# Altium project Receiver_prj.PrjPcb
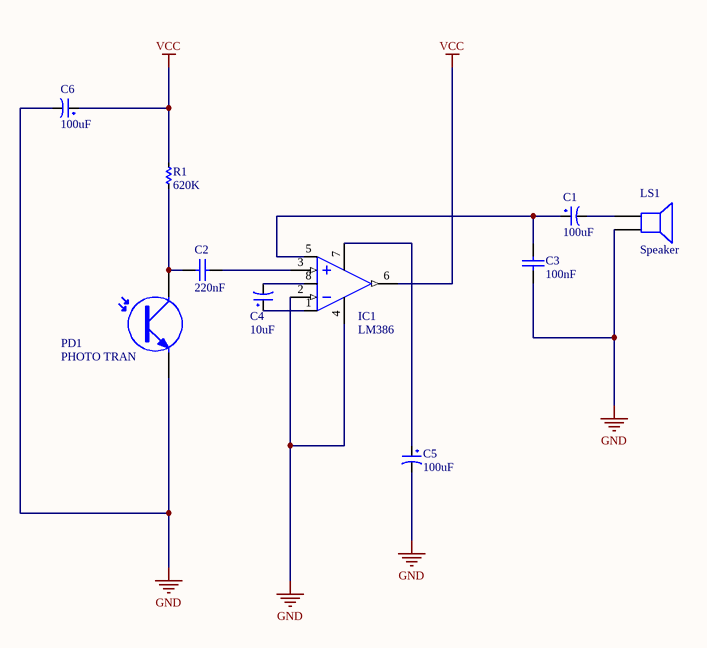
[diagram p0: receiver_SCH.SchDoc]
1 sheet, 10 parts. Net scope: global (net labels, ports and power ports of the same name join across sheets).
Board file: receiver_PCB.PcbDoc

## Sheet receiver_SCH.SchDoc
size A; SheetNumber: 1; SheetTotal: 1

### Parts
C1  100uF  [tu hoa 5mm]
C2  value 220nF  [CN1.5]  (hidden comment: Cap Non-Pol)
C3  value 100nF  [CN1.5]  (hidden comment: Cap Non-Pol)
C4  10uF  [tu hoa 4mm]
C5  100uF  [tu hoa 5mm]
C6  100uF  [tu hoa 5mm]
IC1  LM386  [DIP8]
LS1  Speaker  [SP1]
PD1  PHOTO TRAN  [LED-5TRED]
R1  620K  [RES-2W]

### Nets
GND: C3.2 C5.2 C6.2 IC1.2(IN-) IC1.4(-V) LS1.2 PD1.2(E)
VCC: C6.1 IC1.6(OUT) R1.1
NetC1_1: C1.1 C3.1 IC1.5(-V)
NetC1_2: C1.2 LS1.1
NetC2_1: C2.1 PD1.1(C) R1.2
NetC2_2: C2.2 IC1.3(IN+)
NetC4_1: C4.1 IC1.1(-V)
NetC4_2: C4.2 IC1.8(-V)
NetC5_1: C5.1 IC1.7(+V)

### Library data of the parts
C1 C5 C6 = Tu Hoa 100uF 25V 6x11: Cắm; Don_Vi: Con; So_Chan: 2; Ten_Linh_Kien: Tụ Hóa 100uF 25V 6x11MM; Ma_Hang: MH001351; Chung_Loai: Cắm; Kieu_Chan: *
C2 C3 = Cap Non-Pol: Capacitor
C4 = Tu Hoa 10uF 25V 4x7: Cắm; So_Chan: 2; Ten_Linh_Kien: Tụ Hóa 10uF 25V 4x7MM; Don_Vi: Con; Ma_Hang: MH001349; Chung_Loai: Cắm; Kieu_Chan: *
IC1 = LM386: Low-Power Dual Operational Amplifier; Value: LM358
LS1 = Speaker: Loudspeaker; Published: 24-Mar-1999; LatestRevisionDate: 17-Jul-2002; LatestRevisionNote: Re-released for DXP Platform.; PackageReference: PIN2; Publisher: Altium Limited
R1 = Res: Manufacturer: Generic Components; Class: Passive; SubClass: R; Published: 08/06/2000; Publisher: Altium Hobart Technology Centre
PD1 = Photo TRAN: Published: 24-Mar-1999; LatestRevisionDate: 17-Jul-2002; LatestRevisionNote: Re-released for DXP Platform.; PackageReference: TO-220_A; Publisher: Altium Limited; Code_JEDEC: TO-220-AC